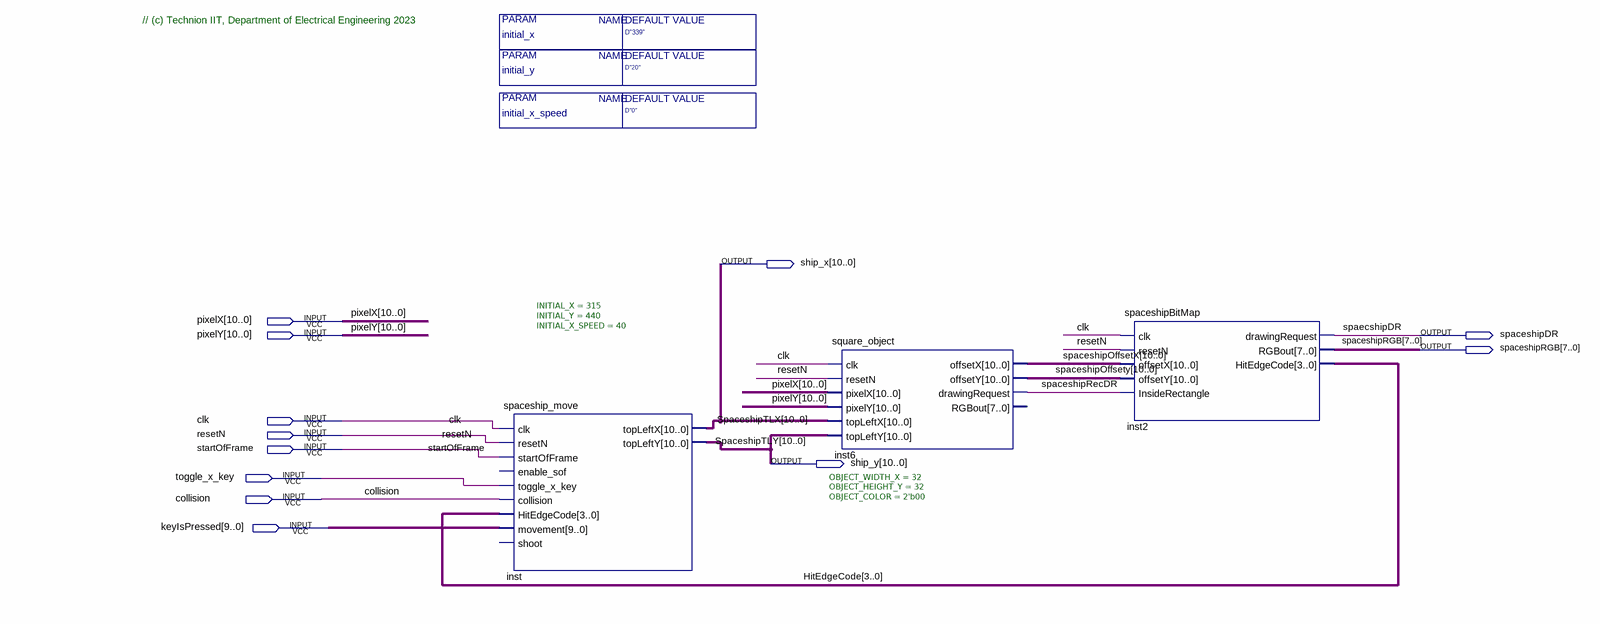
[diagram p0: schematic sheet]
// Quartus schematic Spaceship_Block_T.bdf as structural Verilog: 3 symbols, 12 pins
module Spaceship_Block_T #(parameter initial_x = "D\"339\"", parameter initial_y = "D\"20\"", parameter initial_x_speed = "D\"0\"") (
  input  [10:0] pixelX,
  input  [10:0] pixelY,
  input  clk,
  input  resetN,
  input  startOfFrame,
  input  toggle_x_key,
  input  collision,
  input  [9:0] keyIsPressed,
  output [10:0] ship_x,
  output spaceshipDR,
  output [7:0] spaceshipRGB,
  output [10:0] ship_y
);

  wire spaceshipRecDR;
  wire [3:0] HitEdgeCode;
  wire [10:0] spaceshipOffsetX, spaceshipOffsety;

  spaceship_move #(.INITIAL_X(315), .INITIAL_Y(440), .INITIAL_X_SPEED(40)) inst (
    .clk(clk), .resetN(resetN), .startOfFrame(startOfFrame), .toggle_x_key(toggle_x_key),
    .collision(collision), .HitEdgeCode(HitEdgeCode), .movement(keyIsPressed), .topLeftX(ship_x),
    .topLeftY(ship_y));  // open: enable_sof, shoot
  square_object #(.OBJECT_WIDTH_X(32), .OBJECT_HEIGHT_Y(32), .OBJECT_COLOR(2'b00)) inst6 (
    .clk(clk), .resetN(resetN), .pixelX(pixelX), .pixelY(pixelY), .topLeftX(ship_x), .topLeftY(ship_y),
    .offsetX(spaceshipOffsetX), .offsetY(spaceshipOffsety), .drawingRequest(spaceshipRecDR));  // open: RGBout
  spaceshipBitMap inst2 (
    .clk(clk), .resetN(resetN), .offsetX(spaceshipOffsetX), .offsetY(spaceshipOffsety),
    .InsideRectangle(spaceshipRecDR), .drawingRequest(spaceshipDR), .RGBout(spaceshipRGB),
    .HitEdgeCode(HitEdgeCode));

  // Other names for the same wires on the sheet: SpaceshipTLX[10:0] = ship_x; SpaceshipTLY[10:0] = ship_y;
  //   spaecshipDR = spaceshipDR

  // Notes on the sheet:
  //   // (c) Technion IIT, Department of Electrical Engineering 2023
endmodule
